# Altium project ad_via_motors.PrjPcb
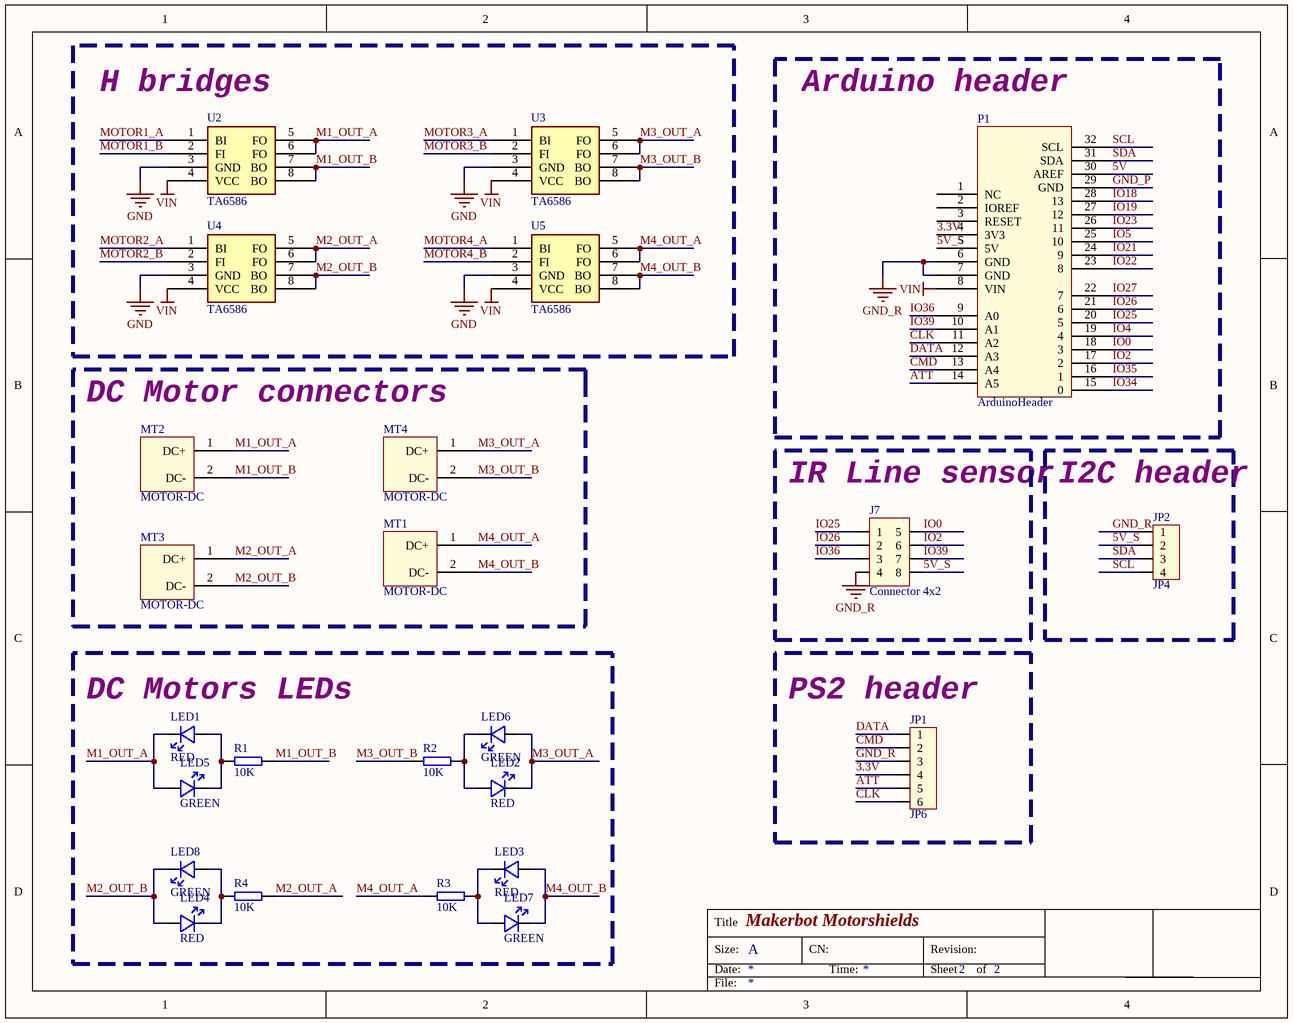
[diagram p0: H-brigde_connector.SchDoc]
Add: 29 Duong Khuê; Au: Tú Ð?ng; codename: BANHMI; Draw: Draw by:; Org: Maker Vi?t; Prj: 2022 VIA Project; Rev: B.12.2; Title: Makerbot Motorshields; Year: @2022
2 sheets, 45 parts. Net scope: global (net labels, ports and power ports of the same name join across sheets).
Board file: ad_motor3.PcbDoc
Sheets:
  H-brigde_connector.SchDoc
  VIA_MOTORS.SchDoc

## Sheet H-brigde_connector.SchDoc: Makerbot Motorshields
size A; Date: 988; DrawnBy: Tu Dang; Organization: Maker Vi?t; Address1: 29 Duong Khuê; Address2: 2022 VIA Project; Address3: Draw by:; Address4: Tú Ð?ng; DocumentNumber: BANHMI; Revision: B.12.2; SheetNumber: 2; SheetTotal: 2; Application_BuildNumber: 213

### Parts
J7  Connector 4x2  [JP4x2]
JP1  JP6  [CON6]
JP2  JP4  [CONN-TH_XH2.54-4AW]
LED1  RED  [SMT0603P]
LED2  RED  [SMT0603P]
LED3  RED  [SMT0603P]
LED4  RED  [SMT0603P]
LED5  GREEN  [SMT0603P]
LED6  GREEN  [SMT0603P]
LED7  GREEN  [SMT0603P]
LED8  GREEN  [SMT0603P]
MT1  MOTOR-DC  [CON2-5.08DC]
MT2  MOTOR-DC  [CON2-5.08DC]
MT3  MOTOR-DC  [CON2-5.08DC]
MT4  MOTOR-DC  [CON2-5.08DC]
P1  ArduinoHeader  [ArduinoClone2]
R1  value 10K  [SMT0603]  (hidden comment: Resistor)
R2  value 10K  [SMT0603]  (hidden comment: Resistor)
R3  value 10K  [SMT0603]  (hidden comment: Resistor)
R4  value 10K  [SMT0603]  (hidden comment: Resistor)
U2  TA6586  [DIP.100/8/W.300/L.400]
U3  TA6586  [DIP.100/8/W.300/L.400]
U4  TA6586  [DIP.100/8/W.300/L.400]
U5  TA6586  [DIP.100/8/W.300/L.400]

### Blocks framed on the sheet
H bridges: U2-U5
Arduino header: P1
IR Line sensor: J7
I2C header: JP2
DC Motors LEDs: LED1-LED8 R1-R4
PS2 header: JP1

### Nets
5V: P1.30(AREF)
GND: U2.3(GND) U3.3(GND) U4.3(GND) U5.3(GND)
GND_P: P1.29(GND)
GND_R: J7.4 JP1.3 JP2.1 P1.6(GND) P1.7(GND)
VIN: P1.8(VIN) U2.4(VCC) U3.4(VCC) U4.4(VCC) U5.4(VCC)
3.3V: JP1.4 P1.4(3V3)
5V_S: J7.8 JP2.2 P1.5(5V)
ATT: JP1.5 P1.14(A5)
CLK: JP1.6 P1.11(A2)
CMD: JP1.2 P1.13(A4)
DATA: JP1.1 P1.12(A3)
IO0: J7.5 P1.18(3)
IO2: J7.6 P1.17(2)
IO4: P1.19(4)
IO5: P1.25(10)
IO18: P1.28(13)
IO19: P1.27(12)
IO21: P1.24(9)
IO22: P1.23(8)
IO23: P1.26(11)
IO25: J7.1 P1.20(5)
IO26: J7.2 P1.21(6)
IO27: P1.22(7)
IO34: P1.15(0)
IO35: P1.16(1)
IO36: J7.3 P1.9(A0)
IO39: J7.7 P1.10(A1)
M1_OUT_A: LED1.2 LED5.1 MT2.1(DC+) U2.5(FO) U2.6(FO)
M1_OUT_B: MT2.2(DC-) R1.2 U2.7(BO) U2.8(BO)
M2_OUT_A: MT3.1(DC+) R4.1 U4.5(FO) U4.6(FO)
M2_OUT_B: LED4.1 LED8.2 MT3.2(DC-) U4.7(BO) U4.8(BO)
M3_OUT_A: LED2.2 LED6.1 MT4.1(DC+) U3.5(FO) U3.6(FO)
M3_OUT_B: MT4.2(DC-) R2.2 U3.7(BO) U3.8(BO)
M4_OUT_A: MT1.1(DC+) R3.1 U5.5(FO) U5.6(FO)
M4_OUT_B: LED3.1 LED7.2 MT1.2(DC-) U5.7(BO) U5.8(BO)
MOTOR1_A: U2.1(BI)
MOTOR1_B: U2.2(FI)
MOTOR2_A: U4.1(BI)
MOTOR2_B: U4.2(FI)
MOTOR3_A: U3.1(BI)
MOTOR3_B: U3.2(FI)
MOTOR4_A: U5.1(BI)
MOTOR4_B: U5.2(FI)
SCL: JP2.4 P1.32(SCL)
SDA: JP2.3 P1.31(SDA)
NetLED1_1: LED1.1 LED5.2 R1.1
NetLED2_1: LED2.1 LED6.2 R2.1
NetLED3_2: LED3.2 LED7.1 R3.2
NetLED4_2: LED4.2 LED8.1 R4.2

Not connected (* = marked no-connect by the designer): P1 1(NC) 2(IOREF) 3(RESET)

### Notes on the sheet
- (near MT2) DC Motor connectors
- Title
- Size:
- Date:
- A
- CN:
- Time:
- Revision:
- Sheet
- of
- File:

### Library data of the parts
J7 = JP4x2: Value: Connector 4x2
JP1 = Con6: Connector 6; Value: Connector 6
JP2 = Con4: Connector 4; Value: Connector 4
LED1-LED4 = LNJ237W82RA: LED SM 0603 RED 1V95 FWD VOLTAGE; Supplier 1: Digi-Key; Forward Voltage: 1V95; Supplier Part Number 1: LNJ237W82RACT-ND
LED5-LED8 = LNJ337W83RA: LED SM 0603 GREEN 1V95 FWD VOLTAGE; Supplier 1: Digi-Key; Forward Voltage: 1V95; Supplier Part Number 1: LNJ337W83RACT-ND
R1-R4 = RES-SM-0603-10K: RES SM 0603 10K; Supplier 1: Farnell; Supplier 2: Digi-Key; Supplier Part Number 1: 9330399; Supplier Part Number 2: 541-10.0KHCT-ND

## Sheet VIA_MOTORS.SchDoc: Makerbot Motorshields
size A; Organization: Altium Limited; Address1: L3, 12a Rodborough Rd; Address2: Frenchs Forest; Address3: NSW; Address4: Australia 2086; DocumentNumber: BANHMI; Revision: B.12.2; SheetNumber: 1; SheetTotal: 2
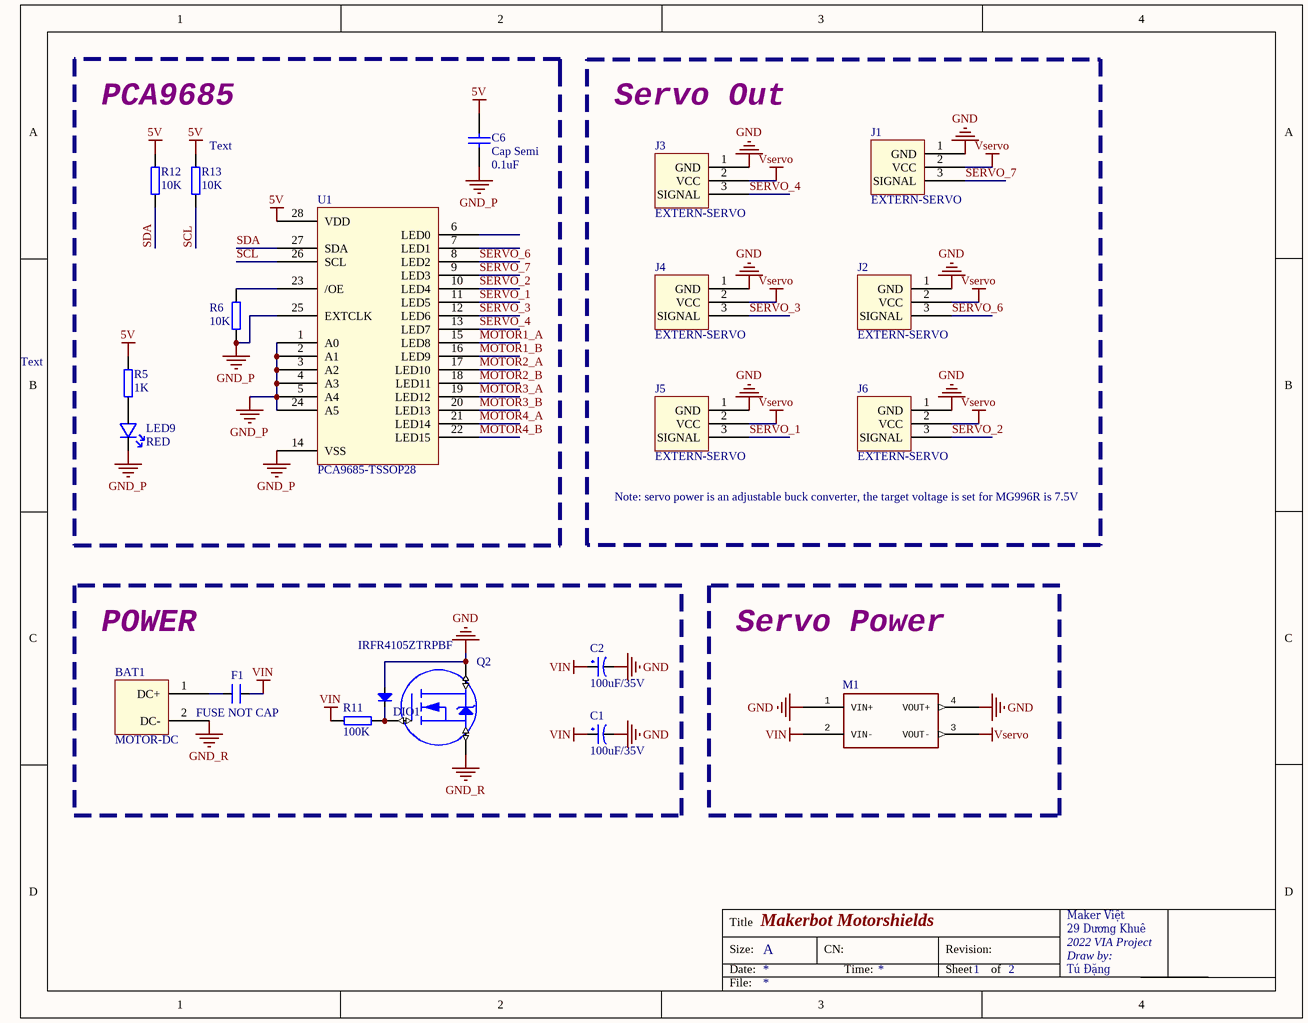
[diagram p1: VIA_MOTORS.SchDoc]

### Parts
BAT1  MOTOR-DC  [CON2-5.08DC]
C1  100uF/35V  [CP1.5/3.4]
C2  100uF/35V  [CP1.5/3.4]
C6  Cap Semi  value 0.1uF  [SMT0603]
DIO1  Diode SMD  [DIO-SMD-123]  (value not drawn)
F1  FUSE NOT CAP  [CN2]
J1  EXTERN-SERVO  [JP3H]
J2  EXTERN-SERVO  [JP3H]
J3  EXTERN-SERVO  [JP3H]
J4  EXTERN-SERVO  [JP3H]
J5  EXTERN-SERVO  [JP3H]
J6  EXTERN-SERVO  [JP3H]
LED9  RED  [SMT0603P]
M1  MP1584-dc-brick-pcb Step down Input: 4.5V - 28V Ouput 0.8V - 25V max. 3A Cheap on ebay  [MP1584 MODULE - duplicate]  (value not drawn)
Q2  IRFR4105ZTRPBF  [TO252-3]
R5  value 1K  [SMT0603]  (hidden comment: Resistor)
R6  value 10K  [SMT0603]  (hidden comment: Resistor)
R11  value 100K  [SMT0603]  (hidden comment: Resistor)
R12  value 10K  [SMT0603]  (hidden comment: Resistor)
R13  value 10K  [SMT0603]  (hidden comment: Resistor)
U1  PCA9685-TSSOP28  [TSSOP28-SMD]

### Blocks framed on the sheet
Servo Out: J1-J6
POWER: BAT1 C1 C2 DIO1 F1 Q2 R11
Servo Power: M1

### Nets
5V: C6.2 R5.2 R12.2 R13.2 U1.28(VDD)
GND: C1.2 C2.2 DIO1.1(A) J1.1(GND) J2.1(GND) J3.1(GND) J4.1(GND) J5.1(GND) J6.1(GND) M1.1(VIN+) M1.4(VOUT+) Q2.2(D@1)
GND_P: C6.1 LED9.2 R6.1 U1.1(A0) U1.2(A1) U1.3(A2) U1.4(A3) U1.5(A4) U1.14(VSS) U1.24(A5) U1.25(EXTCLK)
GND_R: BAT1.2(DC-) Q2.3(S)
VIN: C1.1 C2.1 F1.2 M1.2(VIN-) R11.2
Vservo: J1.2(VCC) J2.2(VCC) J3.2(VCC) J4.2(VCC) J5.2(VCC) J6.2(VCC) M1.3(VOUT-)
MOTOR1_A: U1.15(LED8)
MOTOR1_B: U1.16(LED9)
MOTOR2_A: U1.17(LED10)
MOTOR2_B: U1.18(LED11)
MOTOR3_A: U1.19(LED12)
MOTOR3_B: U1.20(LED13)
MOTOR4_A: U1.21(LED14)
MOTOR4_B: U1.22(LED15)
SCL: R13.1 U1.26(SCL)
SDA: R12.1 U1.27(SDA)
SERVO_1: J5.3(SIGNAL) U1.11(LED5)
SERVO_2: J6.3(SIGNAL) U1.10(LED4)
SERVO_3: J4.3(SIGNAL) U1.12(LED6)
SERVO_4: J3.3(SIGNAL) U1.13(LED7)
SERVO_6: J2.3(SIGNAL) U1.8(LED2)
SERVO_7: J1.3(SIGNAL) U1.9(LED3)
NetBAT1_1: BAT1.1(DC+) F1.1
NetDIO1_2: DIO1.2(K) Q2.1(G) R11.1
NetLED9_1: LED9.1 R5.1
NetR6_2: R6.2 U1.23(/OE)

Not connected (* = marked no-connect by the designer): Q2 PAD(D@2); U1 6(LED0) 7(LED1)

### Notes on the sheet
- PCA9685
- (near R13) Text
- Text
- Note: servo power is an adjustable buck converter, the target voltage is set for MG996R is 7.5V
- Title
- Size:
- Date:
- A
- CN:
- Time:
- Revision:
- Sheet
- of
- Maker Việt
- 29 Dương Khuê
- 2022 VIA Project
- Draw by:
- Tú Đặng
- File:

### Library data of the parts
C1 C2 = CP3: Cap 100uF/35V - 470uF/16V; Value: 100uF/35V/50V; Description 1: 1000uF/6,3V - 470uF/16V - 330uF - 25V; Description 2: 220uF/35V - 100uF/50V - 63V - 4,7uF/200V; Description 3: 22uF => 33uF100V - 3,3uF => 4,7uF/250V; Description 4: 2,2uF =>3,3uF/350 - 2,2uF/400V - 1uF/450V
C6 = CAP-SM-0603-X7R-1uF: CAP SM 0603 X7R 1uF 10%; Tolerance: ±10%; Supplier 1: Digi-Key; Supplier 2: Farnell; Supplier Part Number 1: 490-5307-1-ND; Supplier Part Number 2: 2366834
DIO1 = Diode SMD: Default Diode; Code - JEDEC: DO-214-AB; Value: 1N5007; Published: 8-Jun-2000; Revision: July-2002: Re-released for DXP Platform.; Publisher: Altium Limited
F1 = CN2: Cap np 104 => 105pF; Value: 0.1uF
LED9 = LNJ237W82RA: LED SM 0603 RED 1V95 FWD VOLTAGE; Supplier 1: Digi-Key; Forward Voltage: 1V95; Supplier Part Number 1: LNJ237W82RACT-ND
M1 = MP1584
Q2 = IRFR4105ZTRPBF: RoHS Compliant | Industry-leading quality | Fast Switching | 175C Operating Temperature; MF: Infineon Technologies; MP: IRFR4105ZTRPBF; Check_prices: https://www.snapeda.com/parts/IRFR4105ZTRPBF/Infineon%20Technologies/view-part/821491/?ref=eda; Digi-Key_Part_Number: IRFR4105ZTRPBFCT-ND; Package: TO-252 International Rectifier; Purchase-URL: https://pricing.snapeda.com/search/part/IRFR4105ZTRPBF/?ref=eda; Value: *; SnapEDA_Link: https://www.snapeda.com/parts/IRFR4105ZTRPBF/Infineon%20Technologies/view-part/821491/?ref=snap
R5 = RES-SM-0603-1K: RES SM 0603 1K
R6 R12 R13 = RES-SM-0603-10K: RES SM 0603 10K; Supplier 1: Farnell; Supplier 2: Digi-Key; Supplier Part Number 1: 9330399; Supplier Part Number 2: 541-10.0KHCT-ND
R11 = RES-SM-0603-100K: RES SM 0603 100K; Supplier 1: Farnell; Supplier 2: Digi-Key; Supplier Part Number 1: 1344361; Supplier Part Number 2: 541-100KHCT-ND

## Nets that join several sheets
5V: H-brigde_connector (P1.30), VIA_MOTORS (5 pins)
GND: H-brigde_connector (U2.3 U3.3 U4.3 U5.3), VIA_MOTORS (12 pins)
GND_P: H-brigde_connector (P1.29), VIA_MOTORS (11 pins)
GND_R: H-brigde_connector (5 pins), VIA_MOTORS (BAT1.2 Q2.3)
VIN: H-brigde_connector (5 pins), VIA_MOTORS (5 pins)
MOTOR1_A: H-brigde_connector (U2.1), VIA_MOTORS (U1.15)
MOTOR1_B: H-brigde_connector (U2.2), VIA_MOTORS (U1.16)
MOTOR2_A: H-brigde_connector (U4.1), VIA_MOTORS (U1.17)
MOTOR2_B: H-brigde_connector (U4.2), VIA_MOTORS (U1.18)
MOTOR3_A: H-brigde_connector (U3.1), VIA_MOTORS (U1.19)
MOTOR3_B: H-brigde_connector (U3.2), VIA_MOTORS (U1.20)
MOTOR4_A: H-brigde_connector (U5.1), VIA_MOTORS (U1.21)
MOTOR4_B: H-brigde_connector (U5.2), VIA_MOTORS (U1.22)
SCL: H-brigde_connector (JP2.4 P1.32), VIA_MOTORS (R13.1 U1.26)
SDA: H-brigde_connector (JP2.3 P1.31), VIA_MOTORS (R12.1 U1.27)